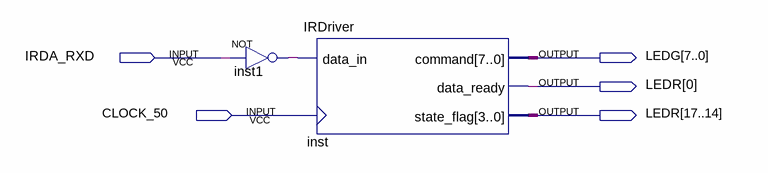
[diagram p0: schematic sheet]
// Quartus schematic ir_driver_test.bdf as structural Verilog: 2 symbols, 5 pins
module ir_driver_test (
  input  IRDA_RXD,
  input  CLOCK_50,
  output [7:0] LEDG,
  output [17:0] LEDR
);

  wire inst1_out;

  not inst1 (inst1_out, IRDA_RXD);
  IRDriver inst (.data_in(inst1_out), .clk(CLOCK_50), .command(LEDG), .data_ready(LEDR[0]), .state_flag(LEDR[17:14]));
endmodule
